# Altium project eta2858_evb.PrjPCB
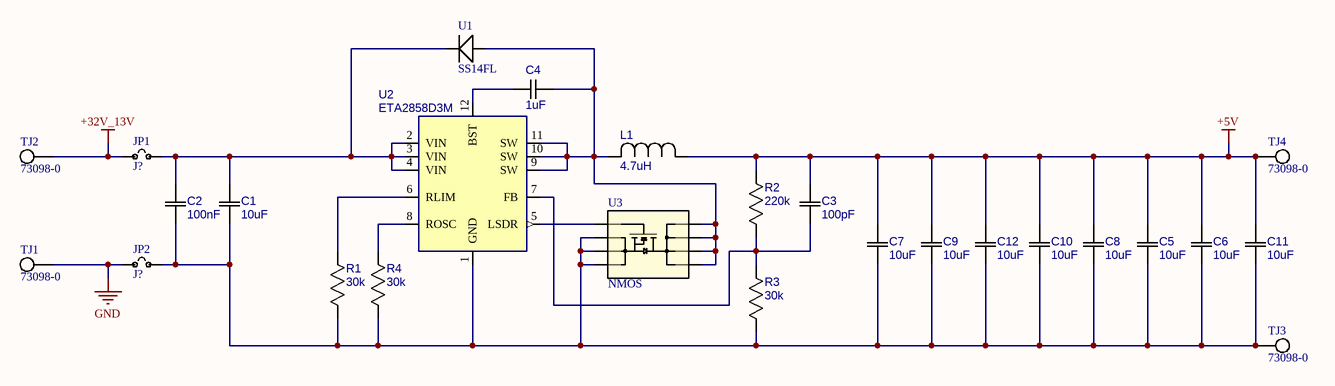
[diagram p0: eta2858_evb.SchDoc]
1 sheet, 26 parts. Net scope: global (net labels, ports and power ports of the same name join across sheets).
Board file: eta2858_evb.PcbDoc

## Sheet eta2858_evb.SchDoc
size A4

### Parts
C1  10uF  [CAP_CL31_SAM]
C2  100nF  [CAP_CC0402_YAG]
C3  100pF  [CAP_CC0402_YAG]
C4  1uF  [*CAPC1608X90]
C5  10uF  [CAP_CL31_SAM]
C6  10uF  [CAP_CL31_SAM]
C7  10uF  [CAP_CL31_SAM]
C8  10uF  [CAP_CL31_SAM]
C9  10uF  [CAP_CL31_SAM]
C10  10uF  [CAP_CL31_SAM]
C11  10uF  [CAP_CL31_SAM]
C12  10uF  [CAP_CL31_SAM]
JP1  J?  [JP]
JP2  J?  [JP]
L1  4.7uH  [IND_SRP1040VA-1R5M_BRN]
R1  30k  [0402_PAN]
R2  220k  [0402_PAN]
R3  30k  [0402_PAN]
R4  30k  [0402_PAN]
TJ1  73098-0  [73098]
TJ2  73098-0  [73098]
TJ3  73098-0  [73098]
TJ4  73098-0  [73098]
U1  SS14FL  [SOD-123_ONS]
U2  ETA2858D3M  [DFN3x3-12]
U3  NMOS  [SMT_009LCG-7_DIO]

### Nets
+5V: C3.2 C5.2 C6.2 C7.2 C8.2 C9.2 C10.2 C11.2 C12.2 L1.1 R2.2 TJ4.T1
+32V_13V: JP1.1(PIN) TJ2.T1
GND: JP2.1(PIN) TJ1.T1
NetC1_1: C1.1 C2.1 C5.1 C6.1 C7.1 C8.1 C9.1 C10.1 C11.1 C12.1 JP2.2(PIN) R1.1 R3.1 R4.1 TJ3.T1 U2.1(GND) U3.1 U3.2 U3.3
NetC1_2: C1.2 C2.2 JP1.2(PIN) U1.1(CATHODE) U2.2(VIN) U2.3(VIN) U2.4(VIN)
NetC3_1: C3.1 R2.1 R3.2 U2.7(FB)
NetC4_1: C4.1 L1.2 U1.2(ANODE) U2.9(SW) U2.10(SW) U2.11(SW) U3.5 U3.6 U3.7 U3.8
NetC4_2: C4.2 U2.12(BST)
NetR1_2: R1.2 U2.6(RLIM)
NetR4_2: R4.2 U2.8(ROSC)
NetU2_5: U2.5(LSDR) U3.4

### Library data of the parts
C1 C5-C12 = CL31B106KBHNNNE: CL31B106KBHNNNE / Multilayer Ceramic Capacitors MLCC - SMD/SMT 10uF+/-10% 50V X7R 3 1206; Mfr.: Samsung Electro-Mechanics; ComponentLink1Description: mouser; ComponentLink1URL: https://www.mouser.hk/ProductDetail/Samsung-Electro-Mechanics/CL31B106KBHNNNE?qs=T0XSgvH75d4ZN8WrMi8xmQ%3D%3D; Mfr. No: CL31B106KBHNNNE
C2 = GCM155R71H104ME02J: GCM155R71H104ME02J / Multilayer Ceramic Capacitors MLCC - SMD/SMT; Mfr.: Murata Electronics; ComponentLink1Description: mouser; ComponentLink1URL: https://www.mouser.hk/ProductDetail/Murata-Electronics/GCM155R71H104ME02J?qs=QzBtWTOodeX25ZLBhHkqFQ%3D%3D; Mfr. No: GCM155R71H104ME02J
C3 = GCM1555C1H101JA16D: GCM1555C1H101JA16D / Multilayer Ceramic Capacitors MLCC - SMD/SMT 100PF 50V 5% 0402; Mfr.: Murata Electronics; ComponentLink1Description: mouser; ComponentLink1URL: https://www.mouser.hk/ProductDetail/Murata-Electronics/GCM1555C1H101JA16D?qs=QDXoN8f0aYJDrHLGHfBgVg%3D%3D; Mfr. No: GCM1555C1H101JA16D
C4 = 0603F105M500NT: 1uF(105) ±20% 50V X7R 0603F105M500NT; MP: C0603C104Z3VACTU; MF: KEMET; Package: 0603 Kemet; Price: None; Value: *; ComponentLink1Description: Taobao; ComponentLink1URL: https://item.taobao.com/item.htm?spm=a1z09.2.0.0.1e6b2e8dpr7A02&id=560896377413&_u=o10quk0k0a55
JP1 JP2 = J
L1 = SRP1040VA-1R5M: Mfr_Name: Bourns Electronics; Manufacturer_Part_Number: SRP1040VA-1R5M; ComponentLink1Description: mouser; ComponentLink1URL: https://www.mouser.hk/ProductDetail/Bel-Signal-Transformer/SCIHP1040-4R7M?qs=sGAEpiMZZMv126LJFLh8y3HRMrH70VMAgNeqJK98o1Y%3D
R1 R3 R4 = RT0402FRE0730KL: RT0402FRE0730KL / Thin Film Resistors - SMD 1/16W 30K ohm 1% 50ppm; Mfr.: YAGEO; ComponentLink1Description: mouser; ComponentLink1URL: https://www.mouser.hk/ProductDetail/YAGEO/RT0402FRE0730KL?qs=BXCcY9r%252B08BWOl0x0896sA%3D%3D; Mfr. No: RT0402FRE0730KL
R2 = RT0402FRE07220KL: RT0402FRE07220KL / Thin Film Resistors - SMD 220K ohm 1% 50ppm High Stability; Mfr.: YAGEO; ComponentLink1Description: mouser; ComponentLink1URL: https://www.mouser.hk/ProductDetail/YAGEO/RT0402FRE07220KL?qs=gY0y7AQI9SMoL0bNFq1hfg%3D%3D; Mfr. No: RT0402FRE07220KL
TJ1-TJ4 = 73098-0: Manufacturer: Pomona Electronics; Manufacturer Product Number: 73098-0; Supplier: Description
U1 = SS14FL: Mfr_Name: onsemi; Copyright: Copyright (C) 2022 Ultra Librarian. All rights reserved.; Manufacturer_Part_Number: SS14FL; RefDes: RefDes; Type: DEV
U3 = DMT10H009LCG-7: Mfr_Name: Diodes Inc; Copyright: Copyright (C) 2022 Ultra Librarian. All rights reserved.; Manufacturer_Part_Number: DMT10H009LCG-7; RefDes: RefDes; Type: DEV